# Altium project Switch Expand.PrjPCB
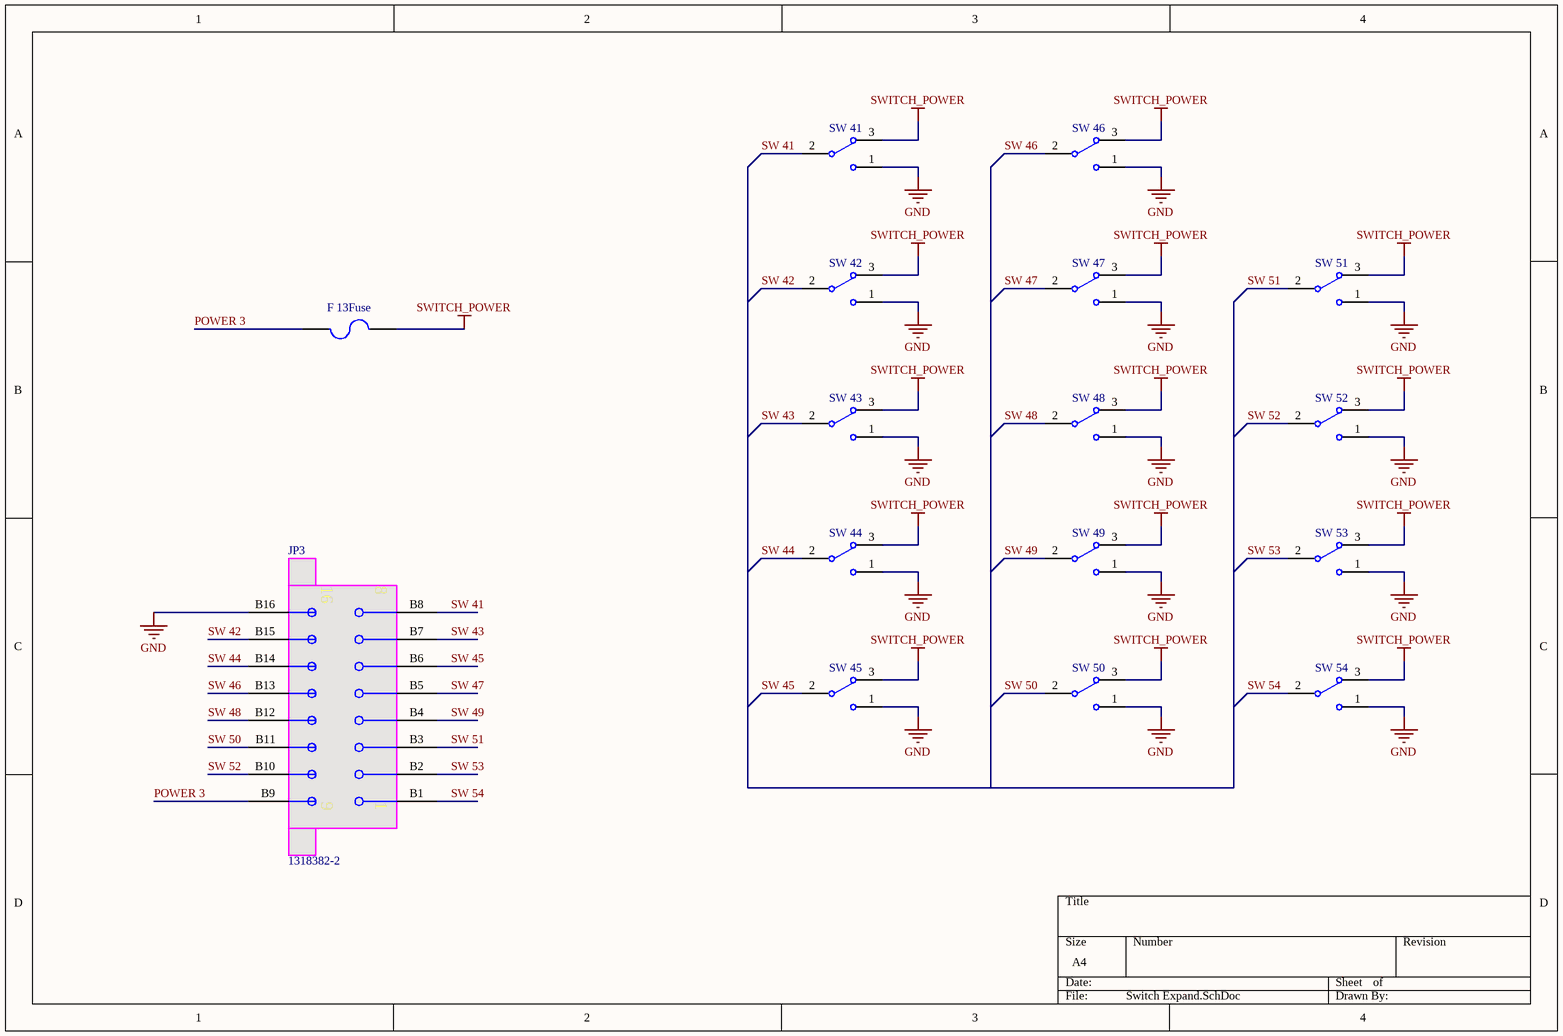
[diagram p0: Switch Expand.SchDoc]
1 sheet, 16 parts. Net scope: global (net labels, ports and power ports of the same name join across sheets).
Board file: Switch Expand.PcbDoc

## Sheet Switch Expand.SchDoc
size A4

### Parts
F_13  Fuse  [FUSE-2pin]
JP3  1318382-2  [AMP1318832-2]
SW_41  SW-SPDT  [Switch-KCD1]  (value not drawn)
SW_42  SW-SPDT  [Switch-KCD1]  (value not drawn)
SW_43  SW-SPDT  [Switch-KCD1]  (value not drawn)
SW_44  SW-SPDT  [Switch-KCD1]  (value not drawn)
SW_45  SW-SPDT  [Switch-KCD1]  (value not drawn)
SW_46  SW-SPDT  [Switch-KCD1]  (value not drawn)
SW_47  SW-SPDT  [Switch-KCD1]  (value not drawn)
SW_48  SW-SPDT  [Switch-KCD1]  (value not drawn)
SW_49  SW-SPDT  [Switch-KCD1]  (value not drawn)
SW_50  SW-SPDT  [Switch-KCD1]  (value not drawn)
SW_51  SW-SPDT  [Switch-KCD1]  (value not drawn)
SW_52  SW-SPDT  [Switch-KCD1]  (value not drawn)
SW_53  SW-SPDT  [Switch-KCD1]  (value not drawn)
SW_54  SW-SPDT  [Switch-KCD1]  (value not drawn)

### Nets
GND: JP3.B16 SW_41.1 SW_42.1 SW_43.1 SW_44.1 SW_45.1 SW_46.1 SW_47.1 SW_48.1 SW_49.1 SW_50.1 SW_51.1 SW_52.1 SW_53.1 SW_54.1
SWITCH_POWER: F_13.2 SW_41.3 SW_42.3 SW_43.3 SW_44.3 SW_45.3 SW_46.3 SW_47.3 SW_48.3 SW_49.3 SW_50.3 SW_51.3 SW_52.3 SW_53.3 SW_54.3
POWER 3: F_13.1 JP3.B9
SW 41: JP3.B8 SW_41.2
SW 42: JP3.B15 SW_42.2
SW 43: JP3.B7 SW_43.2
SW 44: JP3.B14 SW_44.2
SW 45: JP3.B6 SW_45.2
SW 46: JP3.B13 SW_46.2
SW 47: JP3.B5 SW_47.2
SW 48: JP3.B12 SW_48.2
SW 49: JP3.B4 SW_49.2
SW 50: JP3.B11 SW_50.2
SW 51: JP3.B3 SW_51.2
SW 52: JP3.B10 SW_52.2
SW 53: JP3.B2 SW_53.2
SW 54: JP3.B1 SW_54.2

### Library data of the parts
F_13 = Fuse 2: Published: 8-Jun-2000; LatestRevisionDate: 17-Jul-2002; LatestRevisionNote: Re-released for DXP Platform.; PackageReference: PIN-W2/E2.8; Publisher: Altium Limited; PackageDescription: Thru-Hole; 2 Leads
JP3 = 1318832-2
SW_41-SW_54 = SW-SPDT: SPDT Subminiature Toggle Switch, Right Angle Mounting, Vertical Actuation; Published: 24-Mar-1999; LatestRevisionDate: 17-Dec-2003; LatestRevisionNote: Schematic revised, PCB Footprint replaced.; DatasheetVersion: 05-Dec-2000; PackageReference: TL36WW15050; Publisher: Altium Limited; PackageDescription: Switch; 4 Leads; ComponentLink1Description: Manufacturer Link; ComponentLink1URL: http://www.apem.com